# Altium schematic sheet LCD.SchDoc
size A4
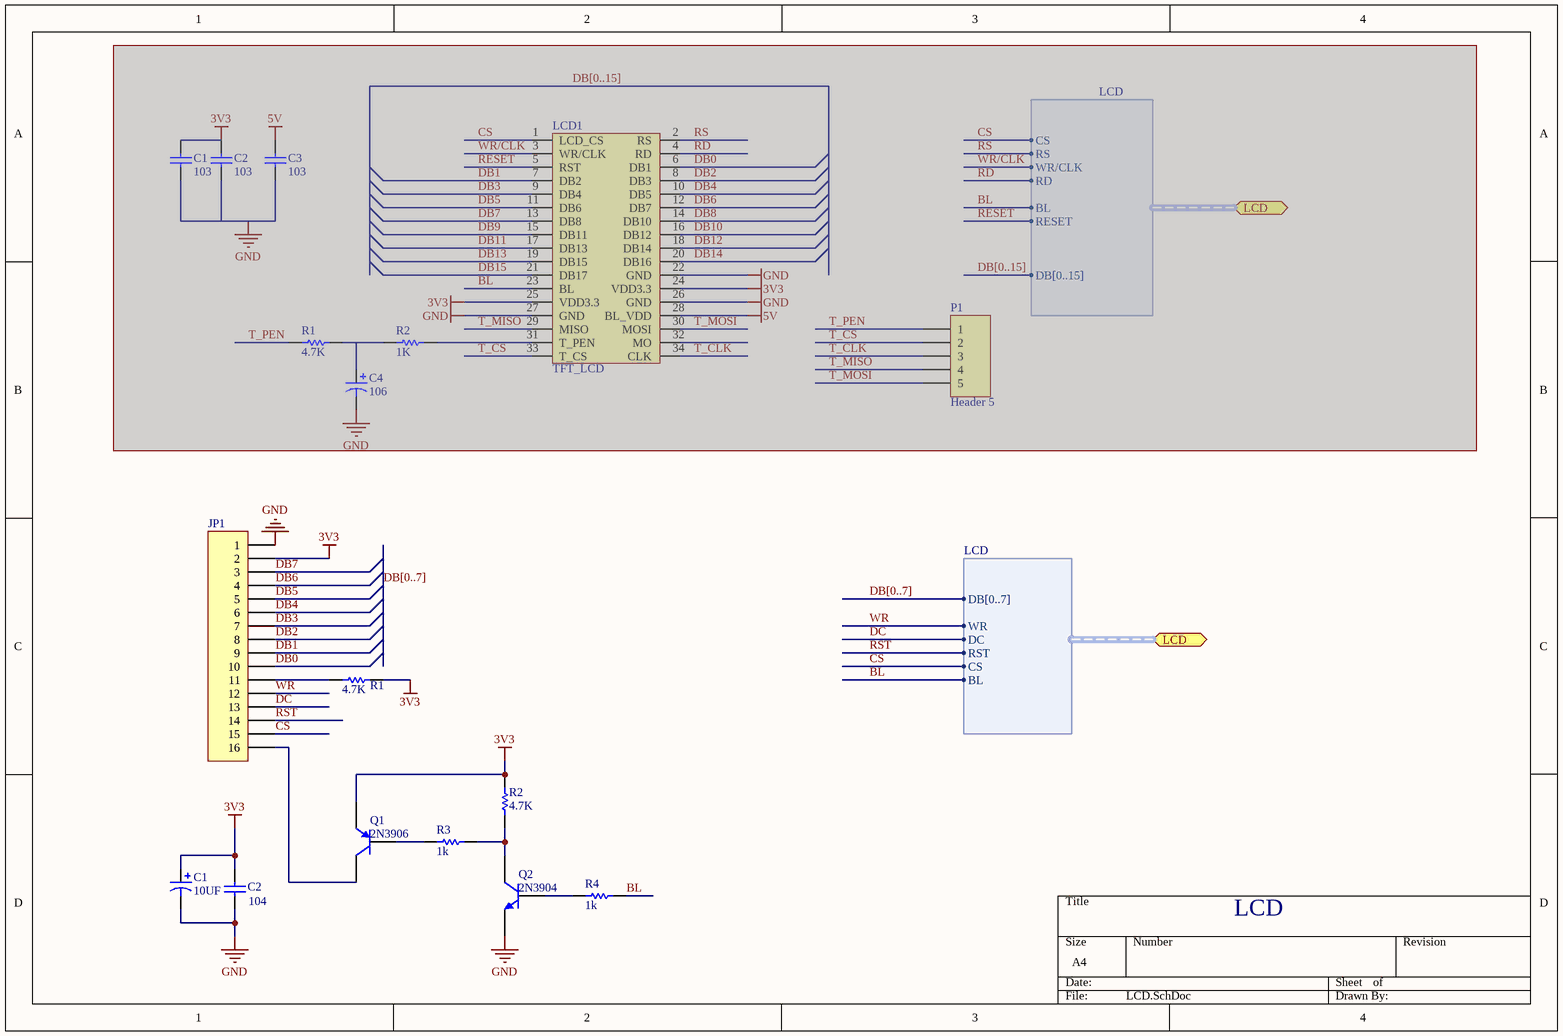
[diagram p0: LCD.SchDoc]

## Parts
(Parts that share a designator on the sheet are numbered #1, #2 ... from top to bottom, then left to right.)
C1#1  value 103  [RC0805]  (hidden comment: Cap)  (masked out: inside a compile mask, not in the netlist)
C1#2  value 10UF  [CAP(106C)]  (hidden comment: Cap Pol1)
C2#1  value 103  [RC0805]  (hidden comment: Cap)  (masked out: inside a compile mask, not in the netlist)
C2#2  value 104  [RC0805]  (hidden comment: Cap)
C3  value 103  [RC0805]  (hidden comment: Cap)  (masked out: inside a compile mask, not in the netlist)
C4  value 106  [CAP(106C)]  (hidden comment: Cap Pol1)  (masked out: inside a compile mask, not in the netlist)
JP1  Header 16  [LCD240120]  (value not drawn)
LCD1  TFT_LCD  [DB2*17]  (masked out: inside a compile mask, not in the netlist)
P1  Header 5  [HDR1X5]  (masked out: inside a compile mask, not in the netlist)
Q1  2N3906  [SOT-23R]
Q2  2N3904  [SOT-23R]
R1#1  value 4.7K  [RC0805]  (hidden comment: Res1)  (masked out: inside a compile mask, not in the netlist)
R1#2  value 4.7K  [RC0805]  (hidden comment: Res1)
R2#1  value 1K  [RC0805]  (hidden comment: Res1)  (masked out: inside a compile mask, not in the netlist)
R2#2  value 4.7K  [RC0805]  (hidden comment: Res1)
R3  value 1k  [RC0805]  (hidden comment: Res1)
R4  value 1k  [RC0805]  (hidden comment: Res1)

## Ports
LCD (harness LCD)

## Harnesses
LCD: CS, RS, WR/CLK, RD, BL, RESET, DB[0..15]
LCD: DB[0..7], WR, DC, RST, CS, BL

## Nets
3V3: C1#2.1 C2#2.1 JP1.2 Q1.1(E) R1#2.2 R2#2.2
GND: C1#2.2 C2#2.2 JP1.1 Q2.1(E)
BL: R4.2 ; port LCD.BL
CS: JP1.15 ; port LCD.CS
DB0: JP1.10
DB1: JP1.9
DB2: JP1.8
DB3: JP1.7
DB4: JP1.6
DB5: JP1.5
DB6: JP1.4
DB7: JP1.3
DC: JP1.13 ; port LCD.DC
RST: JP1.14 ; port LCD.RST
WR: JP1.12 ; port LCD.WR
NetJP1_11: JP1.11 R1#2.1
NetJP1_16: JP1.16 Q1.3(C)
NetQ1_2: Q1.2(B) R3.1
NetQ2_2: Q2.2(B) R4.1
NetQ2_3: Q2.3(C) R2#2.1 R3.2

## Buses and harness runs
bus DB[0..7]

## Notes on the sheet
- LCD

## Library data of the parts
C1#1 C2#1 C2#2 C3 = Cap: Capacitor; Published: 8-Jun-2000; LatestRevisionDate: 17-Jul-2002; LatestRevisionNote: Re-released for DXP Platform.; PackageReference: RAD-0.3; Publisher: Altium Limited; PackageDescription: Radial Cap, Thru-Hole; 2 Leads; 0.3 in Pin Spacing
C1#2 C4 = Cap Pol1: Polarized Capacitor (Radial); Published: 8-Jun-2000; LatestRevisionDate: 17-Jul-2002; LatestRevisionNote: Re-released for DXP Platform.; PackageReference: RB7.6-15; Publisher: Altium Limited; PackageDescription: Polarized Capacitor (Radial); 2 Leads
JP1 = Header 16: Header, 16-Pin; Revision: 17-Jul-2002: Re-released for DXP Platform.; Publisher: Altium Limited
P1 = Header 5: Header, 5-Pin; LatestRevisionDate: 17-Jul-2002; LatestRevisionNote: Re-released for DXP Platform.; Publisher: Altium Limited
Q1 = 2N3906: PNP General Purpose Amplifier; Published: 8-Jun-2000; LatestRevisionDate: 15-Jan-2003; LatestRevisionNote: PCB Footprint 'BCY-W3/D4.7' replaced; DatasheetVersion: 1997; PackageVersion: Sep-1998; PackageReference: TO-92A; Publisher: Altium Limited; PackageDescription: TO, Flat Index; 3 In-Line, Axial Leads; Body Dia. 4.5mm; Leads 0.51 x 0.48 mm (max); ComponentLink1Description: Manufacturer Link; ComponentLink1URL: http://www.fairchildsemi.com/; ComponentLink2Description: Datasheet; ComponentLink2URL: http://www.fairchildsemi.com/ds/2N%2F2N3906.pdf
Q2 = 2N3904: NPN General Purpose Amplifier; Published: 8-Jun-2000; LatestRevisionDate: 15-Jan-2003; LatestRevisionNote: PCB Footprint 'BCY-W3/D4.7' replaced; DatasheetVersion: 1997; PackageVersion: Sep-1998; PackageReference: TO-92A; Publisher: Altium Limited; PackageDescription: TO, Flat Index; 3 In-Line, Axial Leads; Body Dia. 4.5mm; Leads 0.51 x 0.48 mm (max); ComponentLink1Description: Manufacturer Link; ComponentLink1URL: http://www.fairchildsemi.com/; ComponentLink2Description: Datasheet; ComponentLink2URL: http://www.fairchildsemi.com/ds/2N%2F2N3904.pdf
R1#1 R1#2 R2#1 R2#2 R3 R4 = Res1: Resistor; Published: 8-Jun-2000; LatestRevisionDate: 17-Jul-2002; LatestRevisionNote: Re-released for DXP Platform.; PackageReference: AXIAL-0.3; Publisher: Altium Limited; PackageDescription: Axial Device, Thru-Hole; 2 Leads; 0.3 in Pin Spacing